# EAGLE design EchoReverbUnit (EAGLE 9.5.2)

## Sheet 1 of 2
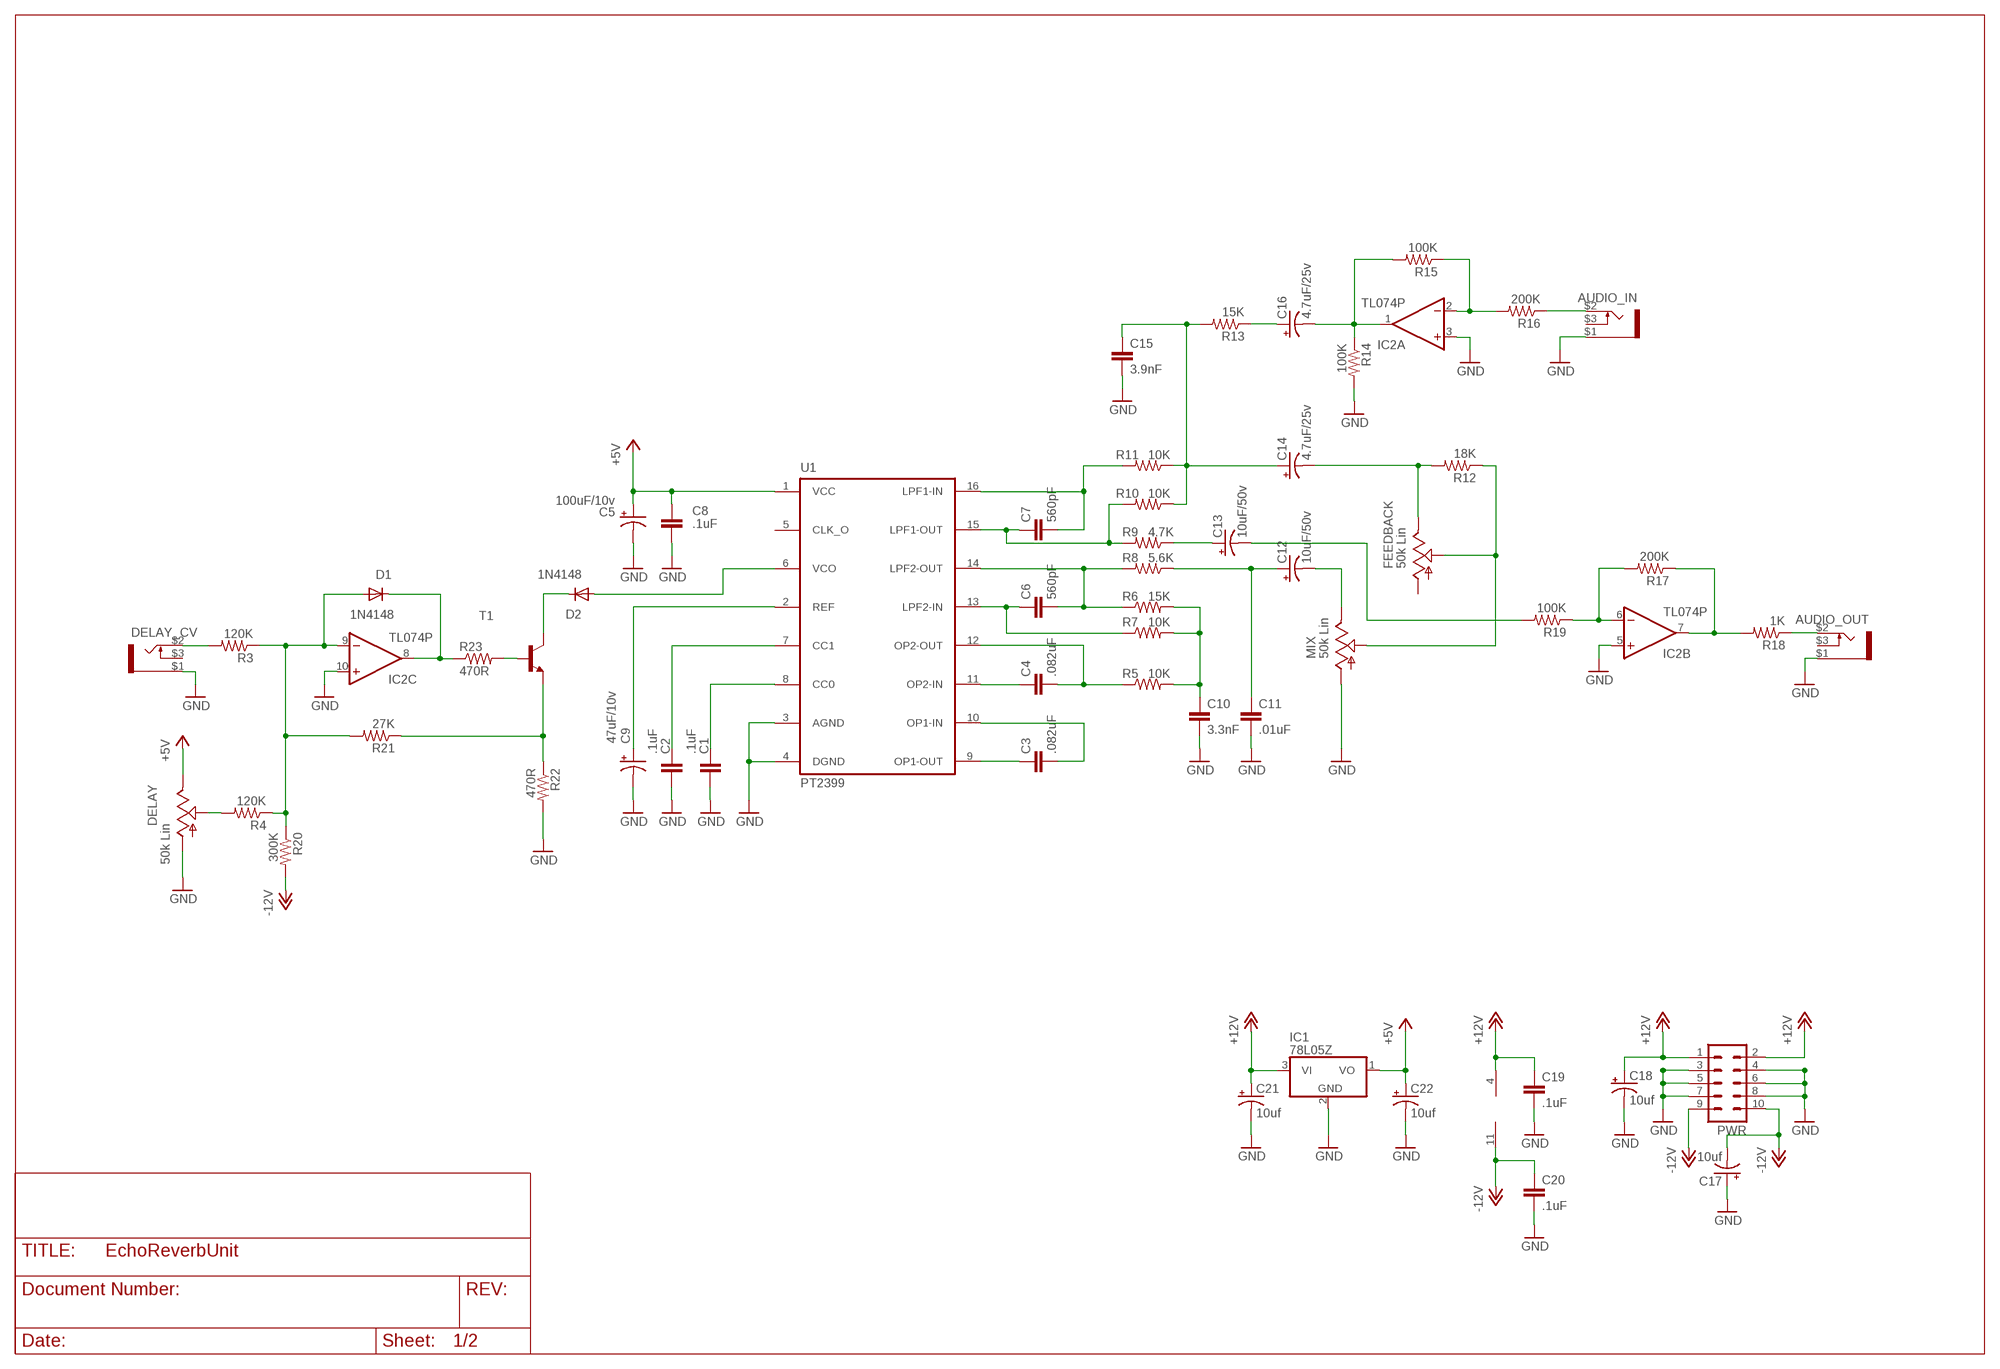
[diagram p0: schematic, sheet 1]

### Parts
AUDIO_IN  PJ-323PJ-323  [PJ-323]
AUDIO_OUT  PJ-323PJ-323  [PJ-323]
C1  .1uF  C-EU050-024X044  [C050-024X044]
C2  .1uF  C-EU050-024X044  [C050-024X044]
C3  .082uF  C-EU050-024X044  [C050-024X044]
C4  .082uF  C-EU050-024X044  [C050-024X044]
C5  100uF/10v  CPOL-USE2.5-6  [E2,5-6]
C6  560pF  C-EU050-024X044  [C050-024X044]
C7  560pF  C-EU050-024X044  [C050-024X044]
C8  .1uF  C-EU050-024X044  [C050-024X044]
C9  47uF/10v  CPOL-USE2.5-6  [E2,5-6]
C10  3.3nF  C-EU050-024X044  [C050-024X044]
C11  .01uF  C-EU050-024X044  [C050-024X044]
C12  10uF/50v  CPOL-USE2.5-6  [E2,5-6]
C13  10uF/50v  CPOL-USE2.5-6  [E2,5-6]
C14  4.7uF/25v  CPOL-USE2.5-6  [E2,5-6]
C15  3.9nF  C-EU050-024X044  [C050-024X044]
C16  4.7uF/25v  CPOL-USE2.5-6  [E2,5-6]
C17  10uf  CPOL-USE2.5-5  [E2,5-5]
C18  10uf  CPOL-USE2.5-5  [E2,5-5]
C19  .1uF  C-EU050-024X044  [C050-024X044]
C20  .1uF  C-EU050-024X044  [C050-024X044]
C21  10uf  CPOL-USE2.5-5  [E2,5-5]
C22  10uf  CPOL-USE2.5-5  [E2,5-5]
D1  1N4148  1N4148DO35-7  [DO35-7]
D2  1N4148  1N4148DO35-7  [DO35-7]
DELAY  50k Lin  RIGHT-ANGLE-POTA  [EVUF]
DELAY_CV  PJ-323PJ-323  [PJ-323]
FEEDBACK  50k Lin  RIGHT-ANGLE-POTA  [EVUF]
IC1  78L05Z  [TO92]
IC2  TL074P  [DIL14]
MIX  50k Lin  RIGHT-ANGLE-POTA  [EVUF]
PWR  ML10  [ML10]
R3  120K  R-US_0207/7  [0207/7]
R4  120K  R-US_0207/7  [0207/7]
R5  10K  R-US_0207/7  [0207/7]
R6  15K  R-US_0207/7  [0207/7]
R7  10K  R-US_0207/7  [0207/7]
R8  5.6K  R-US_0207/7  [0207/7]
R9  4.7K  R-US_0207/7  [0207/7]
R10  10K  R-US_0207/7  [0207/7]
R11  10K  R-US_0207/7  [0207/7]
R12  18K  R-US_0207/7  [0207/7]
R13  15K  R-US_0207/7  [0207/7]
R14  100K  R-US_0207/7  [0207/7]
R15  100K  R-US_0207/7  [0207/7]
R16  200K  R-US_0207/7  [0207/7]
R17  200K  R-US_0207/7  [0207/7]
R18  1K  R-US_0207/7  [0207/7]
R19  100K  R-US_0207/7  [0207/7]
R20  300K  R-US_0207/7  [0207/7]
R21  27K  R-US_0207/7  [0207/7]
R22  470R  R-US_0207/7  [0207/7]
R23  470R  R-US_0207/7  [0207/7]
T1  2N3904-NPN-TO92-EBC  [TO92-EBC]
U1  PT2399  [DIL16]

### Nets
+5V: C5.+ C8.1 C22.+ DELAY.3(E) IC1.1(VO) U1.1(VCC)
+12V: C18.+ C19.1 C21.+ IC1.3(VI) IC2.4(P:V+) PWR.1 PWR.2
-12V: C17.- C20.1 IC2.11(P:V-) PWR.9 PWR.10 R20.2
DELAY: D2.A U1.6(VCO)
GND: AUDIO_IN.$1 AUDIO_OUT.$1 C1.2 C2.2 C5.- C8.2 C9.- C10.2 C11.2 C15.2 C17.+ C18.- C19.2 C20.2 C21.- C22.- DELAY.1(A) DELAY_CV.$1 IC1.2(GND) IC2.3(A:+IN) IC2.5(B:+IN) IC2.10(C:+IN) MIX.1(A) PWR.3 PWR.4 PWR.5 PWR.6 PWR.7 PWR.8 R14.2 R22.2 U1.3(AGND) U1.4(DGND)
N$1: C1.1 U1.8(CC0)
N$2: C2.1 U1.7(CC1)
N$3: C3.2 U1.10(OP1-IN)
N$4: C3.1 U1.9(OP1-OUT)
N$5: C4.1 U1.11(OP2-IN)
N$6: C4.2 R5.1 U1.12(OP2-OUT)
N$7: C6.1 R7.1 U1.13(LPF2-IN)
N$8: C7.1 R9.2 R10.2 U1.15(LPF1-OUT)
N$9: C6.2 R6.1 R8.2 U1.14(LPF2-OUT)
N$10: C7.2 R11.2 U1.16(LPF1-IN)
N$11: C9.+ U1.2(REF)
N$12: C10.1 R5.2 R6.2 R7.2
N$13: C11.1 C12.+ R8.1
N$14: C12.- MIX.3(E)
N$15: C13.+ R9.1
N$16: C14.+ C15.1 R10.1 R11.1 R13.2
N$17: C14.- FEEDBACK.3(E) R12.2
N$18: FEEDBACK.2(S) MIX.2(S) R12.1
N$19: C16.+ R13.1
N$20: C16.- IC2.1(A:OUT) R14.1 R15.2
N$21: IC2.6(B:-IN) R17.2 R19.1
N$22: AUDIO_IN.$2 R16.1
N$23: IC2.2(A:-IN) R15.1 R16.2
N$24: IC2.7(B:OUT) R17.1 R18.2
N$25: AUDIO_OUT.$2 R18.1
N$26: DELAY.2(S) R4.2
N$27: DELAY_CV.$2 R3.2
N$28: D1.A IC2.9(C:-IN) R3.1 R4.1 R20.1 R21.2
N$29: D1.C IC2.8(C:OUT) R23.1
N$30: R21.1 R22.1 T1.E
N$31: R23.2 T1.B
N$32: D2.C T1.C
OUT: C13.- R19.2
Unconnected: AUDIO_IN.$3 AUDIO_OUT.$3 DELAY_CV.$3 FEEDBACK.1(A) IC2.12(D:+IN) IC2.13(D:-IN) IC2.14(D:OUT) U1.5(CLK_O)

## Sheet 2 of 2

## Library data of the parts
AUDIO_IN AUDIO_OUT DELAY_CV = gerbster:PJ-323
C1-C4 C6-C8 C10 C11 C15 C19 C20 = resistor:C-EU: CAPACITOR, European symbol
C5 C9 C12-C14 C16-C18 C21 C22 = resistor:CPOL-US: POLARIZED CAPACITOR, American symbol
D1 D2 = diode:1N4148: DIODE high speed (Philips)
DELAY FEEDBACK MIX = gerbster:RIGHT-ANGLE-POT: 9 mm Square Rotary Potentiometers Source: Panasonic
IC1 = linear:78*: Positive VOLTAGE REGULATOR Source: http://cache.national.com/ds/LM/LM78L05.pdf http://www.fairchildsemi.com/ds/LM/LM7805.pdf
IC2 = linear:TL074: OP AMP
PWR = con-ml:ML10: HARTING; OC_FARNELL: unknown; OC_NEWARK: unknown
R3-R23 = resistor:R-US_: RESISTOR, American symbol
T1 = transistor-neu-to92:*-NPN-: NPN Transistror
U1 = PT2399:PT2399: Echo Processor IC; AVAILABILITY: Unavailable; DESCRIPTION: Multi-Purpose Pigtail PT2399; MF: AC Delco; MP: PT2399; PACKAGE: None; PRICE: None

## Board
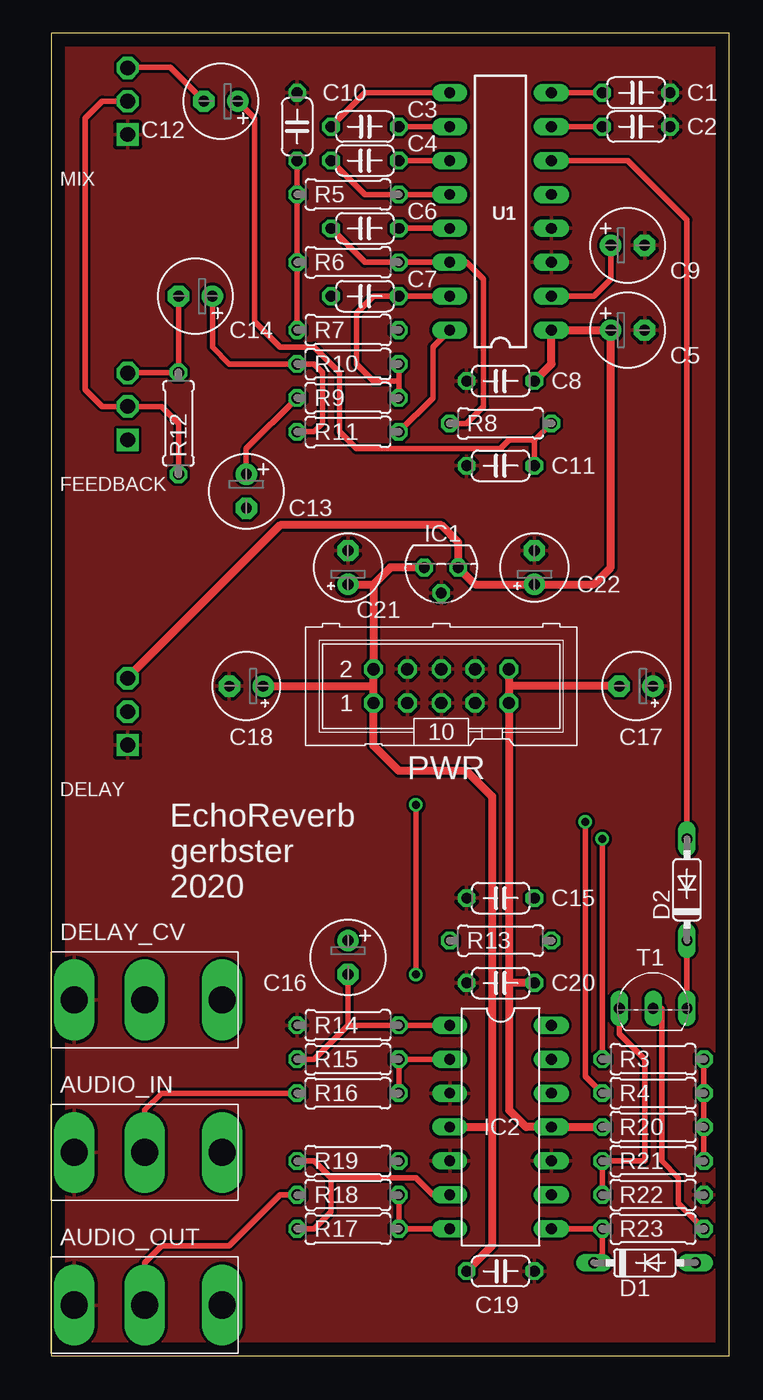
[diagram p1: board, top side]
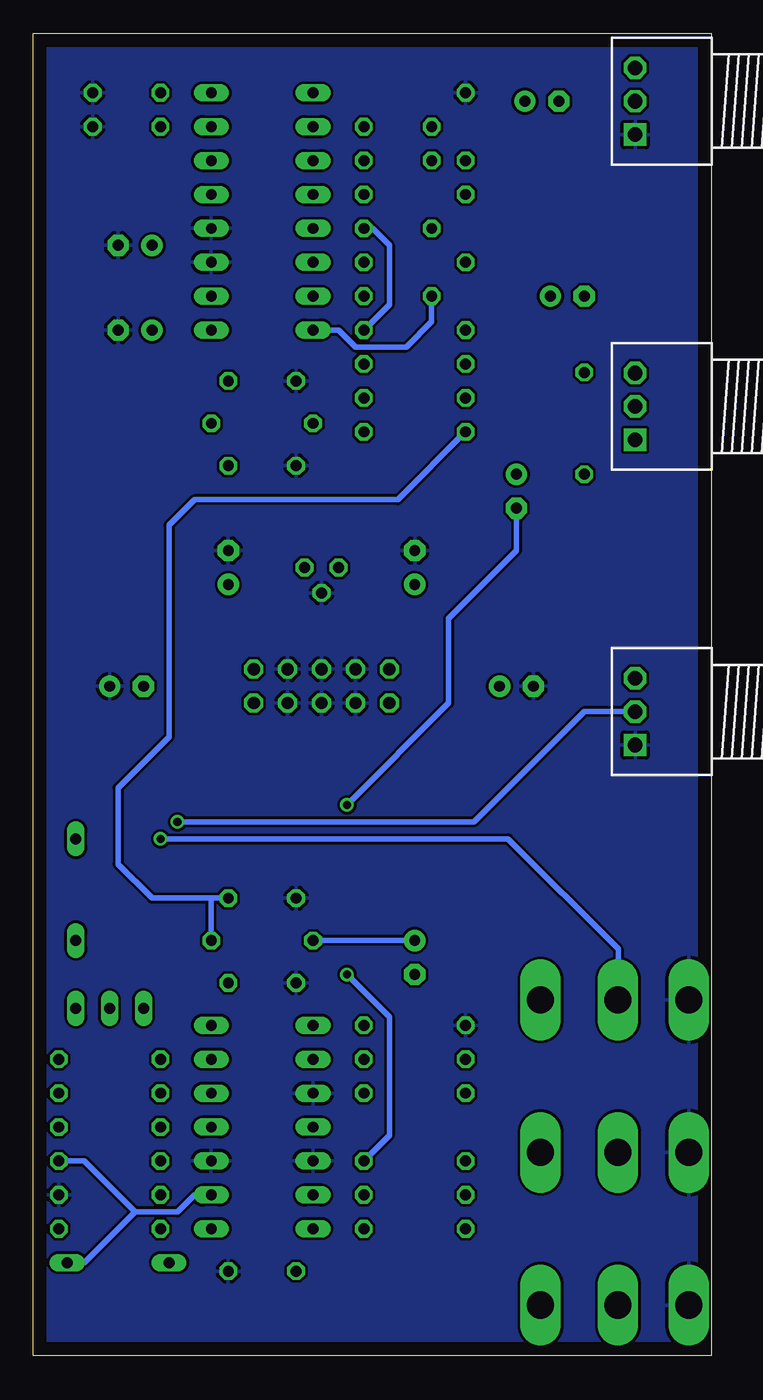
[diagram p2: board, bottom side, seen from below]

Size 50.8 x 99.06 mm. Coordinates in mm from the lower left corner, seen from the top.
Outline: 0,0 50.8,0 50.8,99.06 0,99.06 0,0
Copper layers (1*16): Top 0.035mm / dielectric 1.5mm / Bottom 0.035mm
Design rules "default": minimum track width 10mil, minimum drill 24mil, track to track 8mil, track to pad 8mil, pad to pad 8mil, via to via 8mil, smd to smd 8mil, copper to edge 40mil, drill to drill 8mil, minimum pad ring 10mil, minimum via ring 8mil, stop-mask expansion 4mil, vias tented up to drill 0mil, thermal gap 10mil

### Footprints (pad centres in the part's own frame; a part is rotated, then mirrored left to right if it is on the bottom)
PJ-323 = drill 2.032 pad 2.54 long: $1 0,-1.7; $2 0,-7; $3 0,-12.8
C050-024X044 = drill 0.813 octagon: 1 -2.54,0; 2 2.54,0
E2,5-6 = drill 0.813 pad 1.6: + -1.27,0 | drill 0.813 pad 1.6 octagon: - 1.27,0
E2,5-5 = drill 0.813 pad 1.6: + -1.27,0 | drill 0.813 pad 1.6 octagon: - 1.27,0
DO35-7 = drill 0.813 long: A 3.81,0; C -3.81,0
EVUF = drill 1.1 pad 1.676 square: 1 -2.5,0 | drill 1.1 pad 1.676 octagon: 2 0,0; 3 2.5,0
TO92 = drill 0.813 octagon: 1 -1.27,0; 2 0,1.905; 3 1.27,0
DIL14 = drill 0.813 long: 1 -7.62,-3.81; 2 -5.08,-3.81; 3 -2.54,-3.81; 4 0,-3.81; 5 2.54,-3.81; 6 5.08,-3.81; 7 7.62,-3.81; 8 7.62,3.81; 9 5.08,3.81; 10 2.54,3.81; 11 0,3.81; 12 -2.54,3.81; 13 -5.08,3.81; 14 -7.62,3.81
ML10 = drill 0.914 octagon: 1 -5.08,-1.27; 2 -5.08,1.27; 3 -2.54,-1.27; 4 -2.54,1.27; 5 0,-1.27; 6 0,1.27; 7 2.54,-1.27; 8 2.54,1.27; 9 5.08,-1.27; 10 5.08,1.27
0207/7 = drill 0.813 octagon: 1 -3.81,0; 2 3.81,0
TO92-EBC = drill 0.813 long: B 0,-1.27; C 2.54,-1.27; E -2.54,-1.27
DIL16 = drill 0.813 long: 1 -8.89,-3.81; 2 -6.35,-3.81; 3 -3.81,-3.81; 4 -1.27,-3.81; 5 1.27,-3.81; 6 3.81,-3.81; 7 6.35,-3.81; 8 8.89,-3.81; 9 8.89,3.81; 10 6.35,3.81; 11 3.81,3.81; 12 1.27,3.81; 13 -1.27,3.81; 14 -3.81,3.81; 15 -6.35,3.81; 16 -8.89,3.81

### Placement (x,y rotation side)
AUDIO_IN  0,15.24 90 top
AUDIO_OUT  0,3.81 90 top
C1  43.81,94.61 0 top
C2  43.81,92.08 0 top
C3  23.5,92.08 0 top
C4  23.5,89.53 180 top
C5  43.18,76.83 0 top
C6  23.5,84.45 180 top
C7  23.5,79.38 180 top
C8  33.66,73.03 180 top
C9  43.18,83.19 0 top
C10  18.41,92.08 90 top
C11  33.66,66.67 180 top
C12  12.7,93.98 180 top
C13  14.61,64.77 270 top
C14  10.79,79.38 180 top
C15  33.66,34.29 180 top
C16  22.23,29.84 270 top
C17  43.81,50.16 180 top
C18  14.61,50.16 180 top
C19  33.66,6.35 0 top
C20  33.66,27.94 180 top
C21  22.23,59.05 90 top
C22  36.2,59.05 90 top
D1  44.45,6.99 0 top
D2  47.62,34.92 90 top
DELAY  5.71,48.26 90 top
DELAY_CV  0,26.67 90 top
FEEDBACK  5.71,71.12 90 top
IC1  29.21,59.05 180 top
IC2  33.66,17.14 270 top
MIX  5.71,93.98 90 top
PWR  29.21,50.16 0 top
R3  45.09,22.23 180 top
R4  45.09,19.68 180 top
R5  22.23,87 180 top
R6  22.23,81.92 180 top
R7  22.23,76.83 180 top
R8  33.66,69.85 180 top
R9  22.23,71.75 0 top
R10  22.23,74.3 0 top
R11  22.23,69.22 0 top
R12  9.53,69.85 90 top
R13  33.66,31.11 0 top
R14  22.23,24.77 180 top
R15  22.23,22.23 180 top
R16  22.23,19.68 0 top
R17  22.23,9.53 180 top
R18  22.23,12.06 0 top
R19  22.23,14.61 0 top
R20  45.09,17.14 180 top
R21  45.09,14.61 0 top
R22  45.09,12.06 0 top
R23  45.09,9.53 0 top
T1  45.09,27.3 0 top
U1  33.66,85.72 90 top

### Tracks (layer width: path | path; a pad name or v marks a point on that pad's centre or on a via)
+5V
  Top 0.61: C8.1 37.47,74.3 U1.1 C5.+ 41.91,59.05 40.64,57.78 C22.+ 31.75,57.78 IC1.1 30.48,60.96 29.21,62.23 17.14,62.23 5.71,50.8 DELAY.3
+12V
  Top 0.61: 24.13,50.16 PWR.1 24.13,45.72 26.04,43.81 31.11,43.81 33.02,41.91 33.02,17.14 | 24.13,50.16 PWR.2 24.13,57.78 | 33.02,17.14 33.02,8.26 C19.1 | IC2.4 33.02,17.14 | C18.+ 24.13,50.16 | IC1.3 25.4,59.05 24.13,57.78 | C21.+ 24.13,57.78
-12V
  Top 0.61: R20.2 IC2.11 35.56,17.14 34.29,18.41 34.29,27.94 | PWR.10 34.29,50.16 | 34.29,50.16 PWR.9 34.29,27.94 | C17.- 34.29,50.16 | C20.1 34.29,27.94
DELAY
  Top 0.406: D2.A 47.62,85.09 43.18,89.53 U1.6
GND
  pour Top: 0,99.06 0,0 50.8,0 50.8,99.06
  pour Bottom: 0,99.06 50.8,99.06 50.8,0 0,0
N$1
  Top 0.406: U1.8 C1.1
N$2
  Top 0.406: C2.1 U1.7
N$3
  Top 0.406: U1.10 C3.2
N$4
  Top 0.406: C3.1 23.5,94.61 U1.9
N$5
  Top 0.406: U1.11 C4.1
N$6
  Top 0.406: U1.12 R5.1 23.5,87 C4.2
N$7
  Top 0.406: U1.13 C6.1
  Bottom 0.406: C6.1 25.4,84.45 24.13,83.19 24.13,78.74 R7.1
N$8
  Top 0.406: U1.15 C7.1 24.13,79.38 22.86,78.11 22.86,74.3 24.13,73.03 26.04,73.03 R9.2 R10.2
N$9
  Top 0.406: C6.2 23.5,81.92 R6.1 U1.14 31.11,81.92 32.38,80.64 32.38,71.12 31.11,69.85 R8.2
N$10
  Top 0.406: R11.2 28.57,71.75 28.57,75.56 U1.16
  Bottom 0.406: U1.16 27.94,76.83 26.67,75.56 22.86,75.56 20.95,77.47 C7.2
N$11
  Top 0.406: U1.2 40.64,79.38 41.91,80.64 C9.+
N$12
  Top 0.406: C10.1 R5.2 R6.2 R7.2
N$13
  Top 0.406: 36.2,68.58 R8.1 | C12.+ 15.24,92.71 15.24,77.47 17.14,75.56 19.68,75.56 21.59,73.66 21.59,69.22 22.86,67.94 33.66,67.94 34.29,68.58 36.2,68.58 | C11.1 36.2,68.58
N$14
  Top 0.406: MIX.3 5.75,96.52 8.89,96.52 C12.-
N$15
  Top 0.406: C13.+ 14.61,67.94 R9.1
N$16
  Top 0.406: R11.1 19.68,69.22 20.32,69.85 20.32,73.66 19.68,74.3 R10.1 13.34,74.3 12.06,75.56 C14.+
  Bottom 0.406: R13.2 37.47,34.29 C15.1 41.91,34.29 44.45,36.83 44.45,42.55 40.64,46.35 40.64,62.23 38.73,64.14 23.5,64.14 R11.1
N$17
  Top 0.406: C14.- R12.2 5.75,73.66 FEEDBACK.3
N$18
  Top 0.406: R12.1 9.53,69.85 8.26,71.12 FEEDBACK.2 3.81,71.12 2.54,72.39 2.54,92.71 3.81,93.98 MIX.2
N$19
  Bottom 0.406: C16.+ R13.1
N$20
  Top 0.406: R15.2 19.68,22.23 22.23,24.77 | 22.23,24.77 R14.1 IC2.1 | C16.- 22.23,24.77
N$21
  Top 0.406: R17.2 19.68,9.53 20.95,10.79 20.95,13.34 | 20.95,13.34 19.68,14.61 R19.1 | IC2.6 28.57,12.06 27.3,13.34 20.95,13.34
N$22
  Top 0.406: R16.1 8.26,19.68 6.99,18.41 6.99,15.26 AUDIO_IN.$2
N$23
  Top 0.406: R16.2 R15.1 IC2.2
N$24
  Top 0.406: IC2.7 R17.1 R18.2
N$25
  Top 0.406: 18.54,12.06 R18.1 17.14,12.06 13.34,8.26 8.26,8.26 6.99,6.99 6.99,3.83 AUDIO_OUT.$2
N$26  (via drill 0.61)
  Top 0.406: v40.01,40.01 40.01,20.95 R4.2
  Bottom 0.406: DELAY.2 9.53,48.26 17.78,40.01 v40.01,40.01
N$27  (via drill 0.61)
  Top 0.406: R3.2 v41.27,38.73
  Bottom 0.406: DELAY_CV.$2 6.99,26.68 6.99,30.48 15.24,38.73 v41.27,38.73
N$28
  Top 0.406: R3.1 R4.1 R20.1 R21.2
  Bottom 0.406: R21.2 46.99,14.61 43.18,10.79 | D1.A 46.99,6.99 43.18,10.79 | IC2.9 38.73,12.06 40.01,10.79 43.18,10.79
N$29
  Top 0.406: IC2.8 R23.1 41.27,7.62 D1.C
N$30
  Top 0.406: R22.1 R21.1 44.45,14.61 44.45,22.23 42.55,24.13 T1.E
N$31
  Top 0.406: T1.B 45.72,26.04 45.72,14.61 46.99,13.34 46.99,11.43 R23.2
N$32
  Top 0.406: T1.C D2.C
OUT  (via drill 0.61)
  Top 0.406: v27.3,41.27 v27.3,28.57
  Bottom 0.406: v27.3,28.57 24.13,25.4 24.13,16.51 R19.2 | C13.- 14.61,60.33 19.68,55.24 19.68,48.9 v27.3,41.27

### Text on the board
tNames: EchoReverb / gerbster / 2020